# EAGLE design sensors (EAGLE 9.5.1)
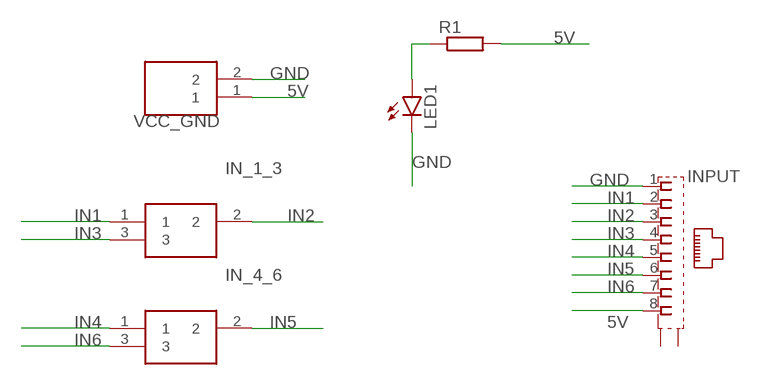
[diagram p0: schematic, sheet 1]

## Parts
IN_1_3  SAMACSYS_PARTS_TB006-508-03BE  [SAMACSYS_PARTS_TB00650803BE]
IN_4_6  SAMACSYS_PARTS_TB006-508-03BE  [SAMACSYS_PARTS_TB00650803BE]
INPUT  GLX-S-88M  [GLX-S-88M]
LED1  LED5MM  [LED5MM]
R1  R-EU_0207/10  [0207/10]
VCC_GND  TB006-508-02BE_TB006-508-02BE  [TB006-508-02BE_CUI_TB006-508-02BE]

## Nets
5V: INPUT.8 R1.2 VCC_GND.1
GND: INPUT.1 LED1.K(C) VCC_GND.2
IN1: IN_1_3.1 INPUT.2
IN2: IN_1_3.2 INPUT.3
IN3: IN_1_3.3 INPUT.4
IN4: IN_4_6.1 INPUT.5
IN5: IN_4_6.2 INPUT.6
IN6: IN_4_6.3 INPUT.7
N$1: LED1.A R1.1
Unconnected: INPUT.S1 INPUT.S2

## Library data of the parts
IN_1_3 IN_4_6 = palames:SAMACSYS_PARTS_TB006-508-03BE: Fixed Terminal Blocks screw type, 5.08 , horizontal, 3 poles, CUI Blue, slotted screw, PCB mount Source: Datasheet <https://componentsearchengine.com/Datasheets/1/TB006-508-03BE.pdf>; DESCRIPTION: Fixed Terminal Blocks screw type, 5.08 , horizontal, 3 poles, CUI Blue, slotted screw, PCB mount; HEIGHT: 10.4mm; MANUFACTURER_NAME: CUI; MANUFACTURER_PART_NUMBER: TB006-508-03BE; MOUSER_PART_NUMBER: 490-TB006-508-03BE; MOUSER_PRICE-STOCK: https://www.mouser.com/Search/Refine.aspx?Keyword=490-TB006-508-03BE
INPUT = con-kycon:GLX-S-88M: Mod. Jack, Right Angle, 8 posiotion, 8 contatcs RJ45 Source: GLX-S-88M.pdf; OC_FARNELL: unknown; OC_NEWARK: unknown
LED1 = led:LED: LED OSRAM: - CHIPLED LG R971, LG N971, LY N971, LG Q971, LY Q971, LO R971, LY R971 LH N974, LH R974 LS Q976, LO Q976, LY Q976 LO Q996 - Hyper CHIPLED LW Q18S LB Q993, LB Q99A, LB R99A - SideLED LS A670, LO A670, LY A670, LG A670, LP A670 LB A673, LV A673, LT A673, LW A673 LH A674 LY A675 LS A676, LA A676, LO A676, LY A676, LW A676 LS A679, LY A679, LG A679 - Hyper Micro SIDELED® LS Y876, LA Y876, LO Y876, LY Y876 LT Y87S - SmartLED LW L88C, LW L88S LB L89C, LB L89S, LG L890 LS L89K, LO L89K, LY L89K LS L896, LA L896, LO L896, LY L896 - TOPLED LS T670, LO T670, LY T670, LG T670, LP T670 LSG T670, LSP T670, LSY T670, LOP T670, LYG T670 LG T671, LOG T671, LSG T671 LB T673, LV T673, LT T673, LW T673 LH T674 LS T676, LA T676, LO T676, LY T676, LB T676, LH T676, LSB T676, LW T676 LB T67C, LV T67C, LT T67C, LS T67K, LO T67K, LY T67K, LW E67C LS E67B, LA E67B, LO E67B, LY E67B, LB E67C, LV E67C, LT E67C LW T67C LS T679, LY T679, LG T679 LS T770, LO T770, LY T770, LG T770, LP T770 LB T773, LV T773, LT T773, LW T773 LH T774 LS E675, LA E675, LY E675, LS T675 LS T776, LA T776, LO T776, LY T776, LB T776 LHGB T686 LT T68C, LB T68C - Hyper Mini TOPLED® LB M676 - Mini TOPLED Santana® LG M470 LS M47K, LO M47K, LY M47K Source: http://www.osram.convergy.de LUXEON: - LUMILED® LXK2-PW12-R00, LXK2-PW12-S00, LXK2-PW14-U00, LXK2-PW14-V00 LXK2-PM12-R00, LXK2-PM12-S00, LXK2-PM14-U00 LXK2-PE12-Q00, LXK2-PE12-R00, LXK2-PE12-S00, LXK2-PE14-T00, LXK2-PE14-U00 LXK2-PB12-K00, LXK2-PB12-L00, LXK2-PB12-M00, LXK2-PB14-N00, LXK2-PB14-P00, LXK2-PB14-Q00 LXK2-PR12-L00, LXK2-PR12-M00, LXK2-PR14-Q00, LXK2-PR14-R00 LXK2-PD12-Q00, LXK2-PD12-R00, LXK2-PD12-S00 LXK2-PH12-R00, LXK2-PH12-S00 LXK2-PL12-P00, LXK2-PL12-Q00, LXK2-PL12-R00 Source: www.luxeon.com KINGBRIGHT: KA-3528ASYC Source: www.kingbright.com
R1 = rcl:R-EU_: RESISTOR, European symbol; SPICEPREFIX: R
VCC_GND = palames:TB006-508-02BE_TB006-508-02BE; AVAILABILITY: Unavailable; CUI_PURCHASE_URL: https://www.cuidevices.com/product/interconnect/connectors/terminal-blocks/tb006-508-series?utm_source=snapeda.com&utm_medium=referral&utm_campaign=snapedaBOM; DESCRIPTION: 2~24 Poles, Screw Type, Horizontal, 5.08 Pitch, 26~14 _AWG_, Terminal Block Connector; MF: CUI Devices; MP: TB006-508-02BE; PACKAGE: None; PRICE: None

## Board
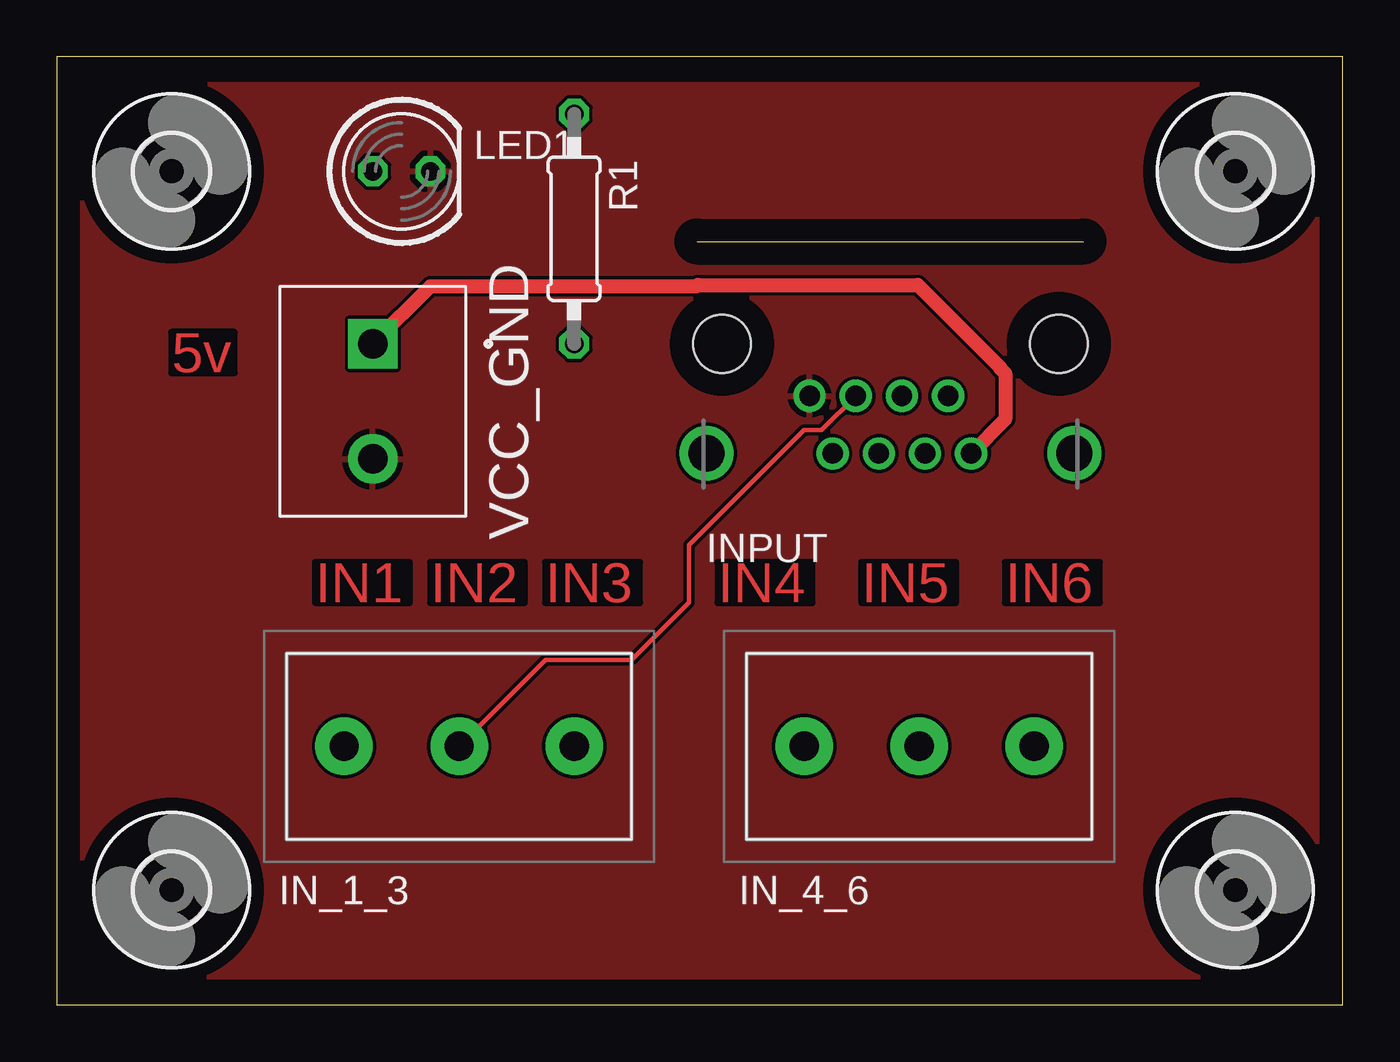
[diagram p1: board, top side]
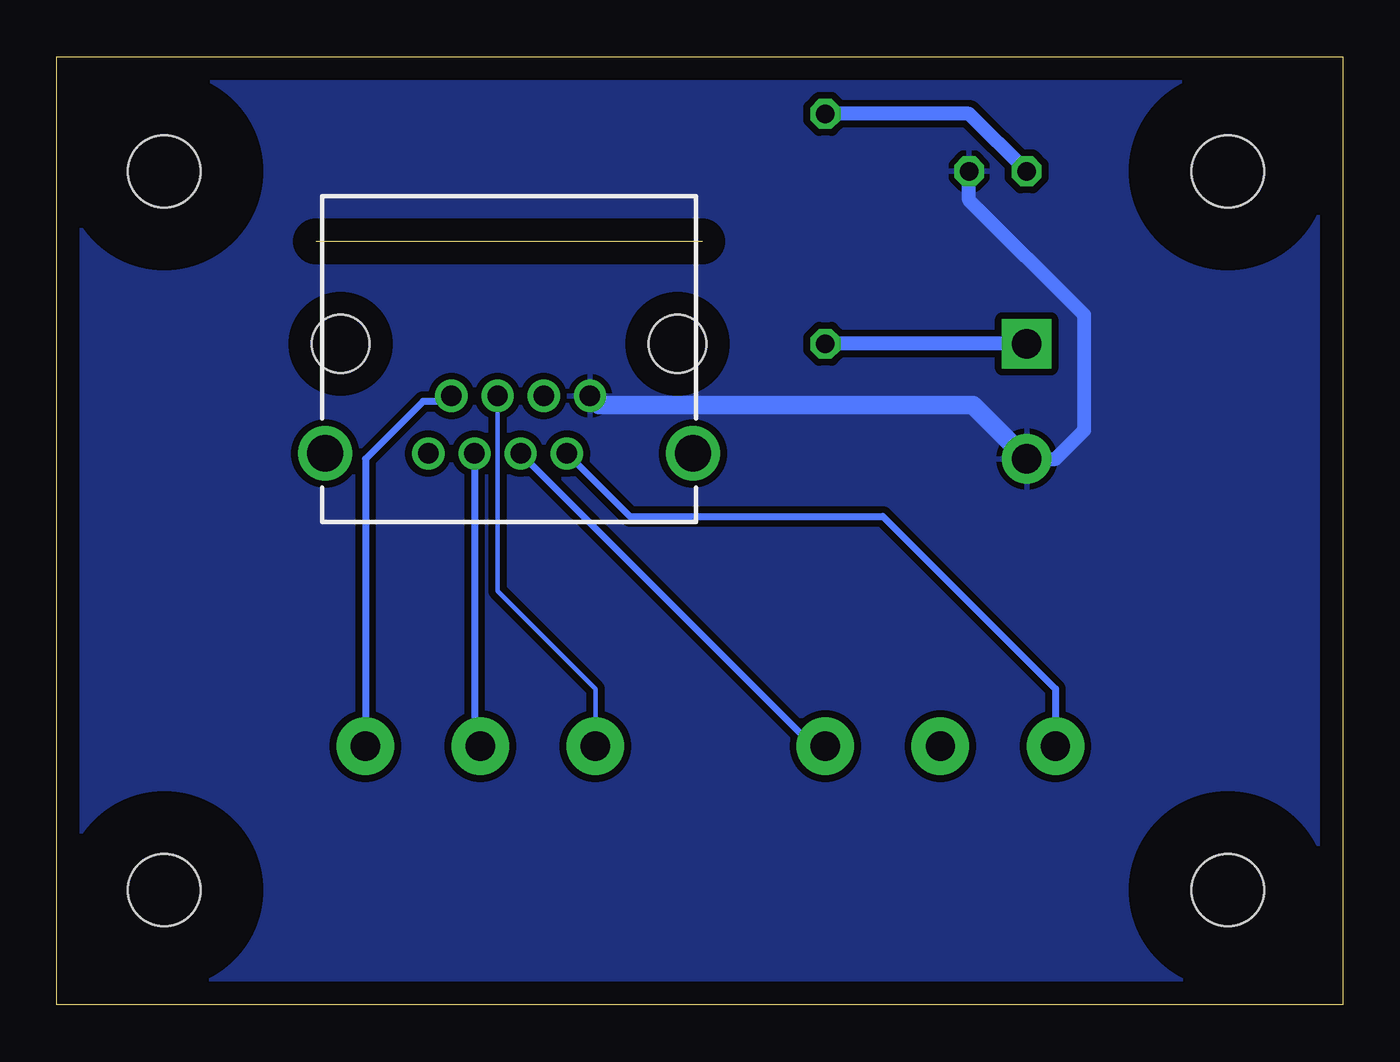
[diagram p2: board, bottom side, seen from below]

Size 56.82 x 41.9 mm. Coordinates in mm from the lower left corner, seen from the top.
Outline: 0,0 56.82,0 56.82,41.9 0,41.9 0,0
Copper layers (1*16): Top 0.035mm / dielectric 1.5mm / Bottom 0.035mm
Design rules "default": minimum track width 6mil, minimum drill 0.35mm, track to track 6mil, track to pad 6mil, pad to pad 6mil, via to via 6mil, smd to smd 6mil, copper to edge 40mil, drill to drill 6mil, minimum pad ring 10mil, minimum via ring 8mil, stop-mask expansion 4mil, vias tented up to drill 0mil, thermal gap 10mil

### Footprints (pad centres in the part's own frame; a part is rotated, then mirrored left to right if it is on the bottom)
SAMACSYS_PARTS_TB00650803BE = drill 1.3 pad 2.54: 1 0,0; 2 5.08,0; 3 10.16,0
GLX-S-88M = drill 0.9 pad 1.422: 1 -3.57,-2.3; 2 -2.55,-4.84; 3 -1.53,-2.3; 4 -0.51,-4.84; 5 0.51,-2.3; 6 1.53,-4.84; 7 2.55,-2.3; 8 3.57,-4.84 | drill 1.6 pad 2.184: S1 -8.125,-4.84; S2 8.125,-4.84 | hole 2.55: -7.44,0; 7.44,0
LED5MM = drill 0.813 octagon: A -1.27,0; K 1.27,0
0207/10 = drill 0.813 octagon: 1 -5.08,0; 2 5.08,0
3,2 = hole 3.2: 0,0
TB006-508-02BE_CUI_TB006-508-02BE = drill 1.3 pad 2.184 square: 1 0,0 | drill 1.3 pad 2.184: 2 5.08,0

### Placement (x,y rotation side)
IN_1_3  12.7,11.43 0 top
IN_4_6  33.02,11.43 0 top
INPUT  36.83,29.21 0 top
LED1  15.24,36.83 0 top
R1  22.86,34.29 270 top
U$1  [3,2]  5.08,36.83 0 top
U$2  [3,2]  52.07,36.83 0 top
U$3  [3,2]  52.07,5.08 0 top
U$4  [3,2]  5.08,5.08 0 top
VCC_GND  13.97,29.21 270 top

### Tracks (layer width: path | path; a pad name or v marks a point on that pad's centre or on a via)
5V
  Top 0.61: VCC_GND.1 16.51,31.75 28.26,31.75 28.31,31.81 38.04,31.81 41.67,28.18 41.67,28.13 41.91,27.9 41.91,25.88 INPUT.8
  Bottom 0.61: VCC_GND.1 R1.2
GND
  Bottom 0.305: 33.02,26.67 INPUT.1
  Bottom 0.61: VCC_GND.2 12.7,24.13 11.43,25.4 11.43,30.48 16.51,35.56 LED1.K
  Bottom 0.813: VCC_GND.2 16.35,26.51 32.86,26.51 33.02,26.67
  pour Bottom (isolate 0.305): 57.15,41.91 0,41.91 0,0 57.15,0
  pour Top: 55.88,40.64 0,40.64 0,1.27 55.88,1.27
IN1
  Bottom 0.305: INPUT.2 31.5,21.59 20.32,21.59 12.7,13.97 IN_1_3.1
IN2
  Top 0.203: IN_1_3.2 21.59,15.24 25.4,15.24 27.94,17.78 27.94,20.32 33.02,25.4 33.79,25.4 INPUT.3
IN3
  Bottom 0.305: INPUT.4 23.38,11.43 IN_1_3.3
IN4
  Bottom 0.203: IN_4_6.1 33.02,13.97 37.34,18.29 INPUT.5
IN5
  Bottom 0.305: INPUT.6 38.36,11.69 IN_4_6.2
IN6
  Bottom 0.305: INPUT.7 39.62,26.67 40.64,26.67 43.18,24.13 IN_4_6.3
N$1
  Bottom 0.61: LED1.A 16.51,39.37 R1.1

### Text on the board
Top: 5v | IN1 | IN2 | IN3 | IN4 | IN5 | IN6